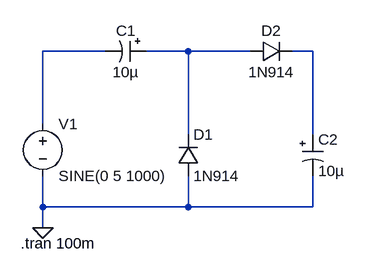
[diagram p0: schematic Lab2_third.asc]
Lab2_third.asc, the LTspice schematic file:
Version 4
SHEET 1 880 680
WIRE -48 16 -144 16
WIRE 80 16 16 16
WIRE 176 16 80 16
WIRE 272 16 240 16
WIRE -144 128 -144 16
WIRE 80 144 80 16
WIRE 272 144 272 16
WIRE -144 256 -144 208
WIRE 80 256 80 208
WIRE 80 256 -144 256
WIRE 272 256 272 208
WIRE 272 256 80 256
WIRE -144 288 -144 256
FLAG -144 288 0
SYMBOL polcap 16 0 R90
WINDOW 0 0 32 VBottom 2
WINDOW 3 32 32 VTop 2
SYMATTR InstName C1
SYMATTR Value 10µ
SYMATTR Description Capacitor
SYMATTR Type cap
SYMATTR SpiceLine V=6.3 Irms=2.21565 Rser=0.055 Lser=0 mfg="KEMET" pn="A700V106M006ATE055" type="Al electrolytic"
SYMBOL polcap 256 144 R0
WINDOW 3 24 56 Left 2
SYMATTR InstName C2
SYMATTR Value 10µ
SYMATTR Description Capacitor
SYMATTR Type cap
SYMATTR SpiceLine V=6.3 Irms=2.21565 Rser=0.055 Lser=0 mfg="KEMET" pn="A700V106M006ATE055" type="Al electrolytic"
SYMBOL voltage -144 112 R0
WINDOW 123 0 0 Left 2
WINDOW 39 0 0 Left 2
SYMATTR InstName V1
SYMATTR Value SINE(0 5 1000)
SYMBOL diode 64 208 M180
WINDOW 0 24 64 Left 2
WINDOW 3 24 0 Left 2
SYMATTR InstName D1
SYMATTR Value 1N914
SYMBOL diode 176 32 R270
WINDOW 0 32 32 VTop 2
WINDOW 3 0 32 VBottom 2
SYMATTR InstName D2
SYMATTR Value 1N914
TEXT -178 312 Left 2 !.tran 100m

The netlist it stands for:
* Lab2_third.asc
C1 N002 N001 10µ V=6.3 Irms=2.21565 Rser=0.055 Lser=0 mfg="KEMET" pn="A700V106M006ATE055" type="Al electrolytic"
C2 N003 0 10µ V=6.3 Irms=2.21565 Rser=0.055 Lser=0 mfg="KEMET" pn="A700V106M006ATE055" type="Al electrolytic"
V1 N001 0 SINE(0 5 1000)
D1 0 N002 1N914
D2 N002 N003 1N914
.model D D
.lib standard.dio
.tran 100m
.backanno
.end